# Altium schematic sheet 7-JTAG & Power.SchDoc: JTAG & Power
size B; CompanyName: NGRF; Address1: 2130 Howard Drive W; Address2: North Mankato, MN 56003; Address3: www.nextgenrf.com; Revision: 2; SheetNumber: 7; SheetTotal: 7; ProjName: BytePipe X9002_HDK; SystemEngineer: ELLIOT NELSON
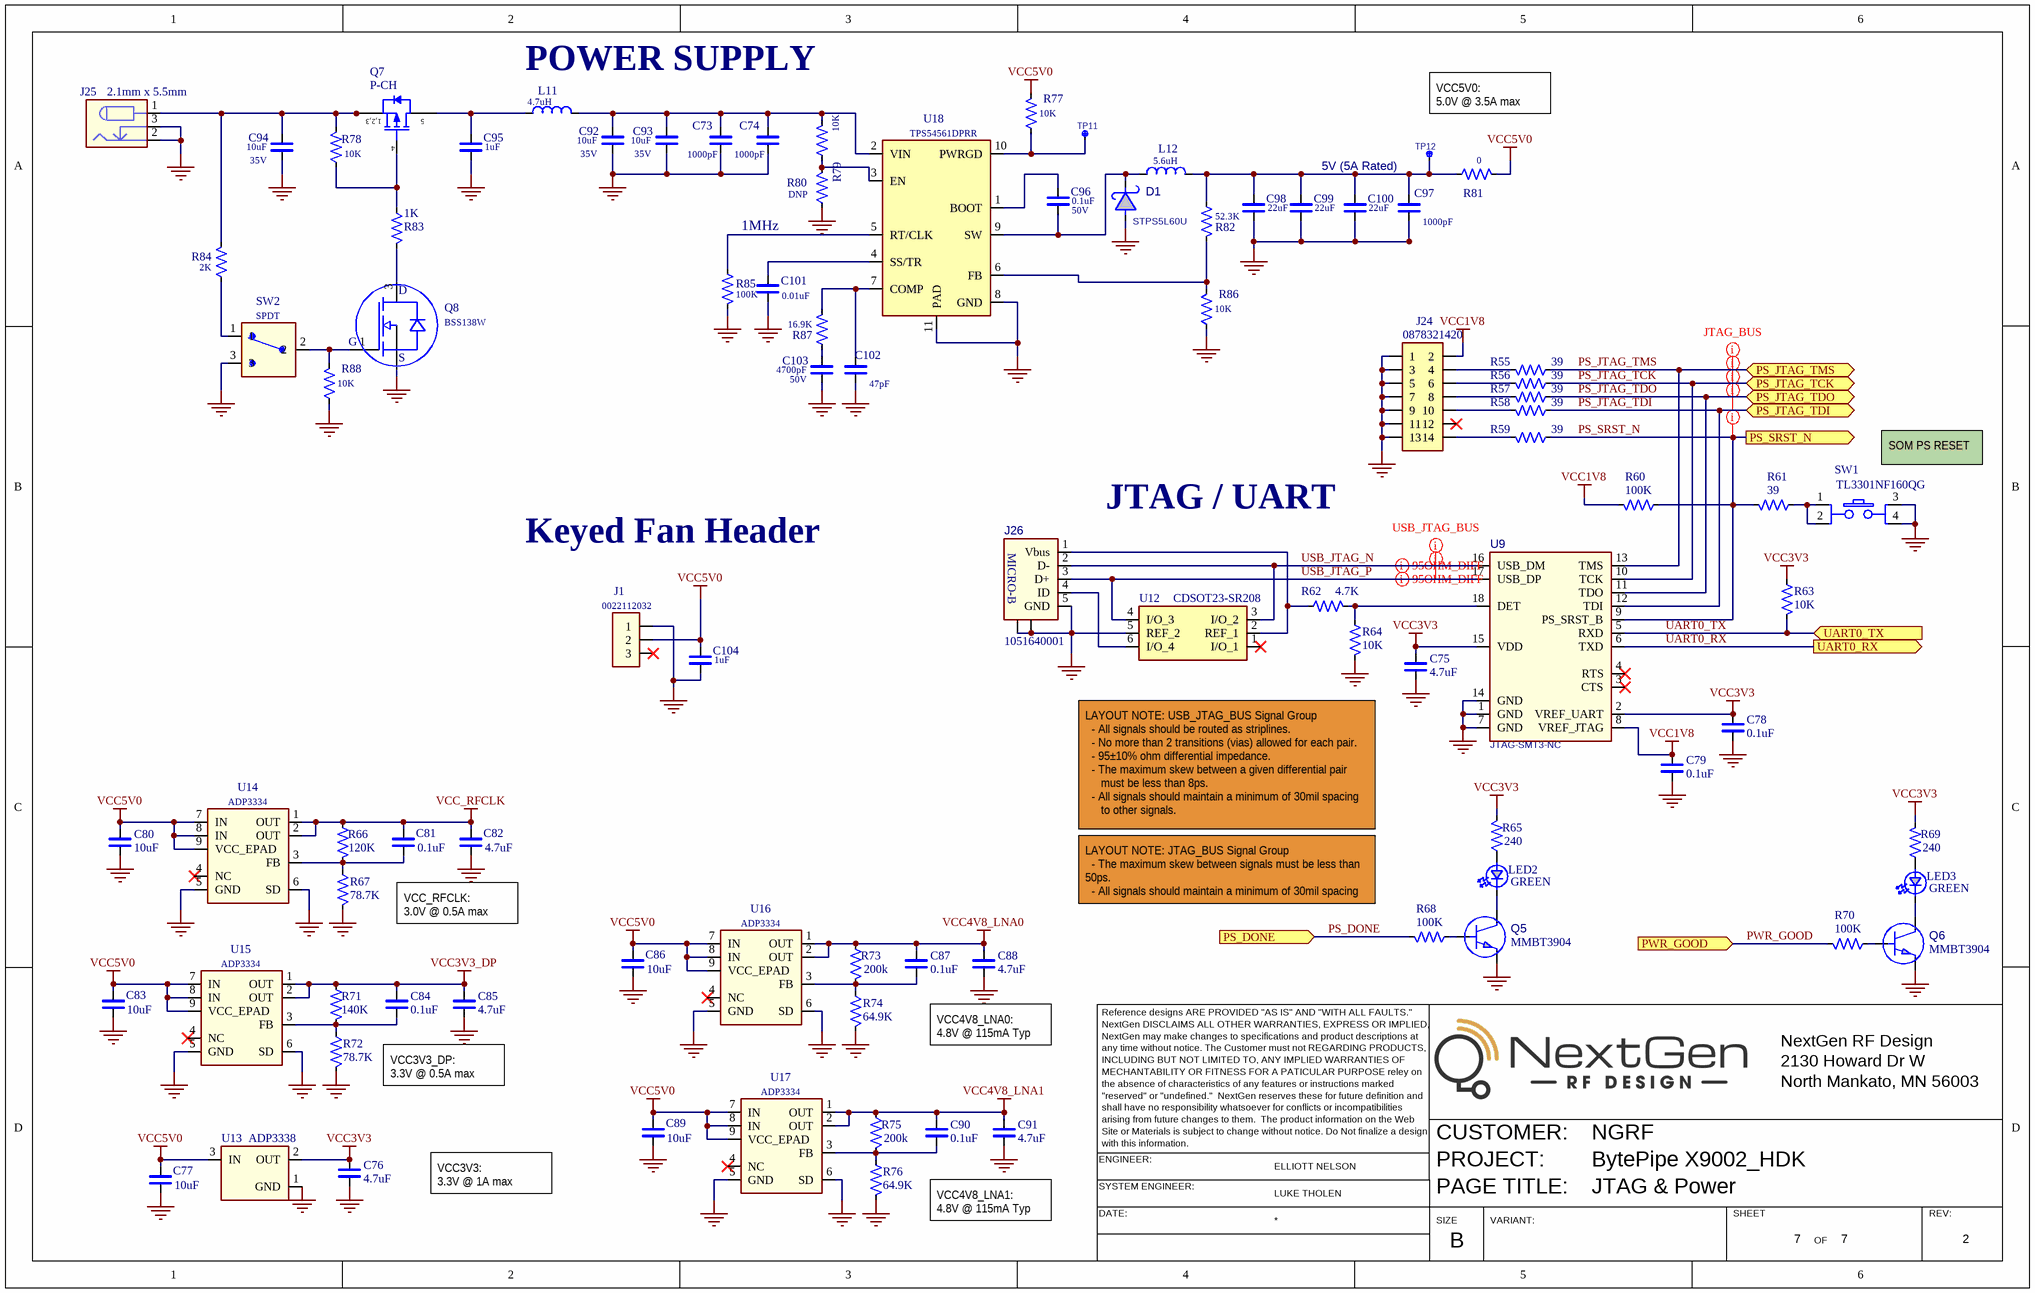
[diagram p0: 7-JTAG & Power.SchDoc]

## Parts
C73  value 1000pF  [SM/0402/CAP]
C74  value 1000pF  [SM/0402/CAP]
C75  value 4.7uF  [SM/0402/CAP]  (hidden comment: CAP_CERAMIC_0402)
C76  value 4.7uF  [SM/0402/CAP]  (hidden comment: CAP_CERAMIC_0402)
C77  value 10uF  [SM/0402/CAP]  (hidden comment: CAP_CERAMIC_0402)
C78  value 0.1uF  [SM/0402/CAP]  (hidden comment: CAP_CERAMIC_0402)
C79  value 0.1uF  [SM/0402/CAP]  (hidden comment: CAP_CERAMIC_0402)
C80  value 10uF  [SM/0402/CAP]  (hidden comment: CAP_CERAMIC_0402)
C81  value 0.1uF  [SM/0402/CAP]  (hidden comment: CAP_CERAMIC_0402)
C82  value 4.7uF  [SM/0402/CAP]  (hidden comment: CAP_CERAMIC_0402)
C83  value 10uF  [SM/0402/CAP]  (hidden comment: CAP_CERAMIC_0402)
C84  value 0.1uF  [SM/0402/CAP]  (hidden comment: CAP_CERAMIC_0402)
C85  value 4.7uF  [SM/0402/CAP]  (hidden comment: CAP_CERAMIC_0402)
C86  value 10uF  [SM/0402/CAP]  (hidden comment: CAP_CERAMIC_0402)
C87  value 0.1uF  [SM/0402/CAP]  (hidden comment: CAP_CERAMIC_0402)
C88  value 4.7uF  [SM/0402/CAP]  (hidden comment: CAP_CERAMIC_0402)
C89  value 10uF  [SM/0402/CAP]  (hidden comment: CAP_CERAMIC_0402)
C90  value 0.1uF  [SM/0402/CAP]  (hidden comment: CAP_CERAMIC_0402)
C91  value 4.7uF  [SM/0402/CAP]  (hidden comment: CAP_CERAMIC_0402)
C92  value 10uF  VOLT: 35V  [SM/0805/CAP]  (hidden comment: CAP_CERAMIC_0805)
C93  value 10uF  VOLT: 35V  [SM/0805/CAP]  (hidden comment: CAP_CERAMIC_0805)
C94  value 10uF  VOLT: 35V  [SM/0805/CAP]  (hidden comment: CAP_CERAMIC_0805)
C95  value 1uF  [SM/0603/CAP]  (hidden comment: CAP_CERAMIC_0603)
C96  value 0.1uF  VOLT: 50V  [SM/0402/CAP]  (hidden comment: CAP_CERAMIC_0402)
C97  value 1000pF  [SM/0402/CAP]
C98  value 22uF  [SM/0805/CAP]  (hidden comment: CAP_CERAMIC_0805)
C99  value 22uF  [SM/0805/CAP]  (hidden comment: CAP_CERAMIC_0805)
C100  value 22uF  [SM/0805/CAP]  (hidden comment: CAP_CERAMIC_0805)
C101  value 0.01uF  [SM/0402/CAP]
C102  value 47pF  [SM/0402/CAP]
C103  value 4700pF  VOLT: 50V  [SM/0402/CAP]
C104  value 1uF  [SM/0603/CAP]  (hidden comment: CAP_CERAMIC_0603)
D1  value STPS5L60U  [SM/DO-214AA/SMB_A]  (hidden comment: DIODE_SCHOTTKY SMB)
J1  0022112032  [CON/MLX/0022112032/3P]
J24  value 0878321420  [SM/CON/MLX/0878321420]  (hidden comment: CON_MOLEX_0878321420_14P)
J25  value 2.1mm x 5.5mm  [CON/WURTH/694106301002]  (hidden comment: CON_WURTH_694106301002)
J26  value 1051640001  [SM/CON/USB/MICRO B RA]  (hidden comment: CON_USB_MICRO-B_RA)
L11  value 4.7uH  [SM/IND/COILCRAFT/XAL4020]  (hidden comment: IND_COILCRAFT_XAL4020)
L12  value 5.6uH  [SM/IND/COILCRAFT/XAL7030]  (hidden comment: IND_COILCRAFT_XAL7030)
LED2  value GREEN  [SM/LED_0603]  (hidden comment: LED_0603)
LED3  value GREEN  [SM/LED_0603]  (hidden comment: LED_0603)
Q5  value MMBT3904  [SM/SOT23_A]  (hidden comment: TRANSISTOR_NPN_SOT23)
Q6  value MMBT3904  [SM/SOT23_A]  (hidden comment: TRANSISTOR_NPN_SOT23)
Q7  value P-CH  [SM/POWERPAK/VISHAY/SO-8]  (hidden comment: MOSFET P-CH 20V 60A PPAK SO-8)
Q8  value BSS138W  [SM/SOT323_A]  (hidden comment: FET_N-CHANNEL_SC70)
R55  value 39  [SM/0402/RES]  (hidden comment: RES_0402_A)
R56  value 39  [SM/0402/RES]  (hidden comment: RES_0402_A)
R57  value 39  [SM/0402/RES]  (hidden comment: RES_0402_A)
R58  value 39  [SM/0402/RES]  (hidden comment: RES_0402_A)
R59  value 39  [SM/0402/RES]  (hidden comment: RES_0402_A)
R60  value 100K  [SM/0402/RES]  (hidden comment: RES_0402_A)
R61  value 39  [SM/0402/RES]  (hidden comment: RES_0402_A)
R62  value 4.7K  [SM/0402/RES]  (hidden comment: RES_0402_A)
R63  value 10K  [SM/0402/RES]  (hidden comment: RES_0402_A)
R64  value 10K  [SM/0402/RES]  (hidden comment: RES_0402_A)
R65  value 240  [SM/0402/RES]  (hidden comment: RES_0402_A)
R66  value 120K  [SM/0402/RES]  (hidden comment: RES_0402_A)
R67  value 78.7K  [SM/0402/RES]  (hidden comment: RES_0402_A)
R68  value 100K  [SM/0402/RES]  (hidden comment: RES_0402_A)
R69  value 240  [SM/0402/RES]  (hidden comment: RES_0402_A)
R70  value 100K  [SM/0402/RES]  (hidden comment: RES_0402_A)
R71  value 140K  [SM/0402/RES]  (hidden comment: RES_0402_A)
R72  value 78.7K  [SM/0402/RES]  (hidden comment: RES_0402_A)
R73  value 200k  [SM/0402/RES]  (hidden comment: RES_0402_A)
R74  value 64.9K  [SM/0402/RES]  (hidden comment: RES_0402_A)
R75  value 200k  [SM/0402/RES]  (hidden comment: RES_0402_A)
R76  value 64.9K  [SM/0402/RES]  (hidden comment: RES_0402_A)
R77  value 10K  [SM/0402/RES]  (hidden comment: RES_0402_A)
R78  value 10K  [SM/0402/RES]  (hidden comment: RES_0402_A)
R79  value 10K  [SM/0402/RES]  (hidden comment: RES_0402_A)
R80  value DNP  [SM/0402/RES]  (hidden comment: RES_0402_A)
R81  value 0  [SM/0805/RES]  (hidden comment: RES_0805_A)
R82  value 52.3K  [SM/0402/RES]  (hidden comment: RES_0402_A)
R83  value 1K  [SM/0402/RES]  (hidden comment: RES_0402_A)
R84  value 2K  [SM/0402/RES]  (hidden comment: RES_0402_A)
R85  value 100K  [SM/0402/RES]  (hidden comment: RES_0402_A)
R86  value 10K  [SM/0402/RES]  (hidden comment: RES_0402_A)
R87  value 16.9K  [SM/0402/RES]  (hidden comment: RES_0402_A)
R88  value 10K  [SM/0402/RES]  (hidden comment: RES_0402_A)
SW1  value TL3301NF160QG  [SM/SWITCH/E-SWITCH/SPST]  (hidden comment: SWITCH_E-SWITCH_TACTILE_SPST)
SW2  value SPDT  [SWITCH/NIDEC/SPDT/AS1D-2M-10-Z]  (hidden comment: AS1D-2M-10-Z)
TP11  TESTPOINT_030  [SM/TESTPOINT/30MIL]  (value not drawn)  (no BOM)
TP12  TESTPOINT_030  [SM/TESTPOINT/30MIL]  (value not drawn)  (no BOM)
U9  value JTAG-SMT3-NC  [SM/MODULE/DIGILENT/JTAG-SMT3]  (hidden comment: MODULE_JTAG-SMT3-NC_18P)
U12  value CDSOT23-SR208  [SM/SOT23-6_C]  (hidden comment: TVS_CDSOT23_SOT23-6_C)
U13  value ADP3338  [SM/SOT223-3_B]  (hidden comment: REG_ADP3338_SOT223-3)
U14  value ADP3334  [SM/DFN8/3x3MM_B]  (hidden comment: REG_ADP334_DFN-8)
U15  value ADP3334  [SM/DFN8/3x3MM_B]  (hidden comment: REG_ADP334_DFN-8)
U16  value ADP3334  [SM/DFN8/3x3MM_B]  (hidden comment: REG_ADP334_DFN-8)
U17  value ADP3334  [SM/DFN8/3x3MM_B]  (hidden comment: REG_ADP334_DFN-8)
U18  value TPS54561DPRR  [SM/WSON10/4x4MM_A]  (hidden comment: REG_TPS54561_WSON-10)

## Ports
PS_DONE (in), PS_JTAG_TCK (bidir), PS_JTAG_TDI (bidir), PS_JTAG_TDO (bidir), PS_JTAG_TMS (bidir), PS_SRST_N (out), PWR_GOOD (in), UART0_RX (out), UART0_TX (in)

## Nets
GND: C73.1(N1) C74.1(N1) C75.2(N2) C76.2(N2) C77.2(N2) C78.2(N2) C79.2(N2) C80.2(N2) C82.2(N2) C83.2(N2) C85.2(N2) C86.2(N2) C88.2(N2) C89.2(N2) C91.2(N2) C92.2(N2) C93.2(N2) C94.2(N2) C95.2(N2) C97.1(N1) C98.2(N2) C99.2(N2) C100.2(N2) C101.1(N1) C102.1(N1) C103.2(N2) C104.2(N2) D1.2(A) J1.1 J24.1 J24.3 J24.5 J24.7 J24.9 J24.11 J24.13 J25.2 J25.3 J26.5(GND) J26.SH J26.TH Q5.2(E) Q6.2(E) Q8.2(SOURCE) R64.2 R67.1 R72.1 R74.1 R76.1 R80.1 R85.2 R86.2 R88.2 SW1.3 SW1.4 SW2.3 U9.1(GND) U9.7(GND) U9.14(GND) U12.5(REF_2) U13.1(GND) U14.5(GND) U14.6(SD) U15.5(GND) U15.6(SD) U16.5(GND) U16.6(SD) U17.5(GND) U17.6(SD) U18.8(GND) U18.11(PAD)
VCC1V8: C79.1(N1) J24.2 R60.2 U9.8(VREF_JTAG)
VCC3V3: C75.1(N1) C76.1(N1) C78.1(N1) R63.1 R65.1 R69.1 U9.2(VREF_UART) U9.15(VDD) U13.2(OUT)
VCC3V3_DP: C84.1(N1) C85.1(N1) R71.2 U15.1(OUT) U15.2(OUT)
VCC4V8_LNA0: C87.1(N1) C88.1(N1) R73.2 U16.1(OUT) U16.2(OUT)
VCC4V8_LNA1: C90.1(N1) C91.1(N1) R75.2 U17.1(OUT) U17.2(OUT)
VCC5V0: C77.1(N1) C80.1(N1) C83.1(N1) C86.1(N1) C89.1(N1) C104.1(N1) J1.2 R77.1 R81.2 U13.3(IN) U14.7(IN) U14.8(IN) U14.9(VCC_EPAD) U15.7(IN) U15.8(IN) U15.9(VCC_EPAD) U16.7(IN) U16.8(IN) U16.9(VCC_EPAD) U17.7(IN) U17.8(IN) U17.9(VCC_EPAD)
VCC_RFCLK: C81.1(N1) C82.1(N1) R66.2 U14.1(OUT) U14.2(OUT)
PS_DONE: R68.2 ; port PS_DONE
PS_JTAG_TCK: R56.1 U9.10(TCK) ; port PS_JTAG_TCK
PS_JTAG_TDI: R58.1 U9.12(TDI) ; port PS_JTAG_TDI
PS_JTAG_TDO: R57.1 U9.11(TDO) ; port PS_JTAG_TDO
PS_JTAG_TMS: R55.1 U9.13(TMS) ; port PS_JTAG_TMS
PS_SRST_N: R59.1 R60.1 R61.2 U9.9(PS_SRST_B) ; port PS_SRST_N
PWR_GOOD: R70.2 ; port PWR_GOOD
UART0_RX: U9.6(TXD) ; port UART0_RX
UART0_TX: R63.2 U9.5(RXD) ; port UART0_TX
USB_JTAG_N: J26.2(D-) U9.16(USB_DM) U12.3(I/O_2)
USB_JTAG_P: J26.3(D+) U9.17(USB_DP) U12.4(I/O_3)
NetC73_2: C73.2(N2) C74.2(N2) C92.1(N1) C93.1(N1) L11.2(N2) R79.2 U18.2(VIN)
NetC81_2: C81.2(N2) R66.1 R67.2 U14.3(FB)
NetC84_2: C84.2(N2) R71.1 R72.2 U15.3(FB)
NetC87_2: C87.2(N2) R73.1 R74.2 U16.3(FB)
NetC90_2: C90.2(N2) R75.1 R76.2 U17.3(FB)
NetC94_1: C94.1(N1) J25.1 Q7.1(SOURCE) Q7.2(SOURCE) Q7.3(SOURCE) R78.1 R84.1
NetC95_1: C95.1(N1) L11.1(N1) Q7.5(DRAIN)
NetC96_1: C96.1(N1) U18.1(BOOT)
NetC96_2: C96.2(N2) D1.1(K) L12.1(N1) U18.9(SW)
NetC97_2: C97.2(N2) C98.1(N1) C99.1(N1) C100.1(N1) L12.2(N2) R81.1 R82.2 TP12.1(N1)
NetC101_2: C101.2(N2) U18.4(SS/TR)
NetC102_2: C102.2(N2) R87.2 U18.7(COMP)
NetC103_1: C103.1(N1) R87.1
NetJ24_4: J24.4 R55.2
NetJ24_6: J24.6 R56.2
NetJ24_8: J24.8 R57.2
NetJ24_10: J24.10 R58.2
NetJ24_14: J24.14 R59.2
NetJ26_1: J26.1(Vbus) R62.1 U12.2(REF_1)
NetJ26_4: J26.4(ID) U12.6(I/O_4)
NetLED2_1: LED2.1(C) Q5.3(C)
NetLED2_2: LED2.2(A) R65.2
NetLED3_1: LED3.1(C) Q6.3(C)
NetLED3_2: LED3.2(A) R69.2
NetQ5_1: Q5.1(B) R68.1
NetQ6_1: Q6.1(B) R70.1
NetQ7_4: Q7.4(GATE) R78.2 R83.1
NetQ8_1: Q8.1(GATE) R88.1 SW2.2
NetQ8_3: Q8.3(DRAIN) R83.2
NetR61_1: R61.1 SW1.1 SW1.2
NetR62_2: R62.2 R64.1 U9.18(DET)
NetR77_2: R77.2 TP11.1(N1) U18.10(PWRGD)
NetR79_1: R79.1 R80.2 U18.3(EN)
NetR82_1: R82.1 R86.1 U18.6(FB)
NetR84_2: R84.2 SW2.1
NetR85_1: R85.1 U18.5(RT/CLK)

Not connected (* = marked no-connect by the designer): J1 3*; J24 12*; U9 3(CTS)* 4(RTS)*; U12 1(I/O_1)*; U14 4(NC)*; U15 4(NC)*; U16 4(NC)*; U17 4(NC)*

## Layout directives
net class USB_JTAG_BUS: USB_JTAG_N, USB_JTAG_P
net class JTAG_BUS: PS_JTAG_TCK, PS_JTAG_TDI, PS_JTAG_TDO, PS_JTAG_TMS, PS_SRST_N
differential pair; Impedance: 90 Ohms; differential pair class 95OHM_DIFF: USB_JTAG_N, USB_JTAG_P

## Notes on the sheet
- (near L11) POWER SUPPLY
- VCC5V0:
  5.0V @ 3.5A max
- 1MHz
- 5V (5A Rated)
- (near SW1) SOM PS RESET
- Keyed Fan Header
- JTAG / UART
- LAYOUT NOTE: USB_JTAG_BUS Signal Group
  - All signals should be routed as striplines.
  - No more than 2 transitions (vias) allowed for each pair.
  - 95±10% ohm differential impedance.
  - The maximum skew between a given differential pair
  must be less than 8ps.
  - All signals should maintain a minimum of 30mil spacing
  to other signals.
- (near R68) LAYOUT NOTE: JTAG_BUS Signal Group
  - The maximum skew between signals must be less than 50ps.
  - All signals should maintain a minimum of 30mil spacing to
  other signals outside this signal group.
- VCC_RFCLK:
  3.0V @ 0.5A max
- VCC4V8_LNA0:
  4.8V @ 115mA Typ
- Reference designs ARE PROVIDED "AS IS" AND "WITH ALL FAULTS."
- NextGen DISCLAIMS ALL OTHER WARRANTIES, EXPRESS OR IMPLIED,
- NextGen may make changes to specifications and product descriptions at
- NextGen RF Design
- VCC3V3_DP:
  3.3V @ 0.5A max
- any time without notice. The Customer must not REGARDING PRODUCTS,
- INCLUDING BUT NOT LIMITED TO, ANY IMPLIED WARRANTIES OF
- MECHANTABILITY OR FITNESS FOR A PATICULAR PURPOSE reley on
- "reserved" or "undefined."  NextGen reserves these for future definition and
- the absence of characteristics of any features or instructions marked
- shall have no responsibility whatsoever for conflicts or incompatibilities
- 2130 Howard Dr W
- North Mankato, MN 56003
- ENGINEER:
- Site or Materials is subject to change without notice. Do Not finalize a design
- with this information.
- arising from future changes to them.  The product information on the Web
- ELLIOTT NELSON
- CUSTOMER:
- PROJECT:
- VCC3V3:
  3.3V @ 1A max
- VCC4V8_LNA1:
  4.8V @ 115mA Typ
- SYSTEM ENGINEER:
- DATE:
- LUKE THOLEN
- SIZE
- PAGE TITLE:
- VARIANT:
- SHEET
- OF
- REV:
- B
- (in symbol CON_USB_MICRO-B_RA) MICRO-B
- (in symbol FET_N-CHANNEL_SC70) D; G; S
- (in symbol FET_P-CHANNEL_PPAK-SO-8) 1,2,3

## Library data of the parts
C73 C74 C97 = CAP_CERAMIC_0402: CAP CER 1000PF 50V C0G/NP0 0402; TOL: 1%; OEM#: GRM1555C1H102FA01D; OEM NAME: Murata Electronics; VOLT: 50V
C75 C76 C82 C85 C88 C91 = CAP_CERAMIC_0402: CAP CER 4.7UF 10V X5R 0402; TOL: ±20%; OEM#: CL05A475MP5NRNC; OEM NAME: Samsung; VOLT: 10V
C77 C80 C83 C86 C89 = CAP_CERAMIC_0402: 10µF ±20% 10V Ceramic Capacitor X5R 0402 (1005 Metric); OEM#: CL05A106MP8NUB8; OEM NAME: Samsung; TOL: ±20%; VOLT: 10V
C78 C79 C81 C84 C87 C90 = CAP_CERAMIC_0402: CAP CER 0.1UF 25V X7R 0402; TOL: ±10%; OEM#: CL05B104KA5NNNC; OEM NAME: Samsung; VOLT: 25V
C92 C93 = CAP_CERAMIC_0805: CAP CER 10UF 35V X5R 0805; OEM#: GRM21BR6YA106ME43L; OEM NAME: Murata Electronics; TOL: 20%
C94 = CAP_CERAMIC_0805: CAP CER 10UF 35V X5R 0805; OEM#: GMK212BBJ106MG-T; OEM NAME: Taiyo Yuden; TOL: 20%
C95 C104 = CAP_CERAMIC_0603: TOL: 10%; OEM#: GRT188R61H105KE13D; OEM NAME: Murata; VOLT: 50V
C96 = CAP_CERAMIC_0402: CAP CER 0.1UF 50V X7R 0402; TOL: 10%; OEM#: CGA2B3X7R1H104K050BB; OEM NAME: TDK Corporation
C98-C100 = CAP_CERAMIC_0805: CAP CER 22UF 16V X5R 0805; OEM#: GRM219R61C226ME15L; OEM NAME: Murata Electronics; TOL: 20%; VOLT: 16V
C101 = CAP_CERAMIC_0402: CAP CER 10000PF 50V X7R 0402; TOL: 10%; OEM#: GCM155R71H103KA55J; OEM NAME: Murata Electronics; VOLT: 50V
C102 = CAP_CERAMIC_0402: CAP CER 47PF 50V C0G/NP0 0402; TOL: 5%; OEM#: GCM1555C1H470JA16D; OEM NAME: Murata Electronics; VOLT: 50V
C103 = CAP_CERAMIC_0402: CAP CER 4700PF 50V X7R 0402; TOL: 10%; OEM#: GRM155R71H472KA01J; OEM NAME: Murata
D1 = DIODE_SCHOTTKY SMB: DIODE SCHOTTKY 60V 5A SMB; OEM NAME: STMicroelectronics; OEM#: STPS5L60U
J1 = CON_100SP_1X3P_MLX_KK100: Connector Header Through Hole 3 position 0.100" (2.54mm).  Molex KK 100 Series.; OEM#: 0022112032; OEM NAME: MOLEX; VALUE: 0022112032
J24 = CON_MOLEX_0878321420_14P: Connector Header Surface Mount 14 position 0.079" (2.00mm); OEM NAME: MOLEX; OEM#: 0878321420
J25 = CON_WURTH_694106301002: Wurth DC power jack, 2.1mm pin, right angle; OEM#: 694106301002; OEM NAME: WURTH
J26 = CON_USB_MICRO-B_RA: USB MICRO-B RIGHT ANGLE, MOLEX 1051640001; OEM NAME: Molex, LLC; OEM#: 1051640001
L11 = IND_COILCRAFT_XAL4020: Fixed Inductors 4.7uH 20% 5.1A 44.1mOhms AEC-Q200; OEM#: XAL4030-472MEC; OEM NAME: Coilcraft
L12 = IND_COILCRAFT_XAL7030: OEM#: XAL7030-562MEC; OEM NAME: Coilcraft
LED2 LED3 = LED_0603: LED-0603; OEM#: LG L29K-F2J1-24-Z; OEM NAME: OSRAM
Q5 Q6 = TRANSISTOR_NPN_SOT23: Bipolar (BJT) Transistor NPN 40V 200mA 300MHz 300mW Surface Mount SOT-23-3 (TO-236); OEM#: MMBT3904LT1G; OEM NAME: ON Semiconductor
Q7 = FET_P-CHANNEL_PPAK-SO-8: P-Channel 20 V 60A (Tc) 6.25W (Ta), 104W (Tc) Surface Mount PowerPAK® SO-8; OEM NAME: VISHAY SILICONIX; OEM#: SI7157DP-T1-GE3
Q8 = FET_N-CHANNEL_SC70: FET, N-Channel, SC70/SOT323; OEM NAME: ON Semi; OEM#: BSS138W
R55-R59 R61 = RES_0402_A: RES SMD 39 OHM 1% 1/10W 0402; OEM#: ERJ-2RKF39R0X; OEM NAME: Panasonic; TOL: 1%
R60 R68 R70 R85 = RES_0402_A: RES SMD 100K OHM 1% 1/10W 0402; OEM#: ERJ-2RKF1003X; OEM NAME: Panasonic; TOL: 1%
R62 = RES_0402_A: RES SMD 4.7K OHM 1% 1/10W 0402; OEM#: ERJ-2RKF4701X; OEM NAME: Panasonic; TOL: 1%
R63 R64 = RES_0402_A: OEM#: ERJ-2RKF1002X; OEM NAME: Panasonic; TOL: ±1%
R65 R69 = RES_0402_A: RES SMD 240 OHM 1% 1/10W 0402; OEM#: ERJ-2RKF2400X; OEM NAME: Panasonic; TOL: 1%
R66 = RES_0402_A: RES 120K OHM 1% 1/10W 0402 SMD; OEM#: ERJ-2RKF1203X; OEM NAME: Panasonic; TOL: ±1%
R67 R72 = RES_0402_A: RES SMD 78.7K OHM 1% 1/10W 0402; OEM#: ERJ-2RKF7872X; OEM NAME: Panasonic; TOL: ±1%
R71 = RES_0402_A: RES SMD 140K OHM 1% 1/10W 0402; OEM#: ERJ-2RKF1403X; OEM NAME: Panasonic; TOL: ±1%
R73 R75 = RES_0402_A: RES SMD 200K OHM 1% 1/10W 0402; OEM#: ERJ-2RKF2003X; OEM NAME: Panasonic; TOL: ±1%
R74 R76 = RES_0402_A: RES SMD 64.9K OHM 1% 1/10W 0402; OEM#: ERJ-2RKF6492X; OEM NAME: Panasonic; TOL: ±1%
R77-R79 R86 R88 = RES_0402_A: RES SMD 10K OHM 1% 1/10W 0402; OEM#: ERJ-2RKF1002X; OEM NAME: Panasonic; TOL: 1%
R80 = RES_0402_A: DNP; OEM NAME: Panasonic; OEM#: DNP
R81 = RES_0805_A: RES SMD 0 OHM JUMPER 1/8W 0805; OEM#: ERJ-6GEY0R00V; OEM NAME: Panasonic
R82 = RES_0402_A: RES SMD 52.3K OHM 1% 1/10W 0402; OEM#: ERJ-2RKF5232X; OEM NAME: Panasonic; TOL: 1%
R83 = RES_0402_A: RES SMD 1K OHM 1% 1/10W 0402; OEM#: ERJ-2RKF1001X; OEM NAME: Panasonic; TOL: ±1%
R84 = RES_0402_A: RES SMD 2 KOHM 1% 1/5W 0402; OEM#: ERJ-PA2F2001X; OEM NAME: Panasonic Electronic Components; TOL: 1%
R87 = RES_0402_A: RES SMD 16.9K OHM 1% 1/10W 0402; OEM#: ERJ-2RKF1692X; OEM NAME: Panasonic; TOL: 1%
SW1 = SWITCH_E-SWITCH_TACTILE_SPST: Tactile Switch SPST-NO Top Actuated Surface Mount; OEM#: TL3301NF160QG; OEM NAME: E-SWITCH
SW2 = SWITCH_SLIDE_NIDEC_SPDT: SWITCH SLIDE SPDT 50MA 48V; OEM NAME: Nidec Copal Electronics; OEM#: AS1D-2M-10-Z
U9 = MODULE_JTAG-SMT3-NC_18P: SMT Programming module for Xilinx FPGAs.; OEM NAME: DIGILENT; OEM#: JTAG-SMT3-NC
U12 = TVS_CDSOT23_SOT23-6_C: Clamp Ipp Tvs Diode Surface Mount SOT-23-6.; OEM NAME: Bourns Inc.; OEM#: CDSOT23-SR208
U13 = REG_ADP3338_SOT223-3: Linear Voltage Regulator IC 3.3V Output 1A SOT-223-3; OEM NAME: ANALOG DEVICES; OEM#: ADP3338AKCZ-3.3-RL
U14-U17 = REG_ADP334_DFN-8: Linear Voltage Regulator IC  1 Output  500mA 8-LFCSP-WD (3x3); OEM#: ADP3334ACPZ-REEL7; OEM NAME: ANALOG DEVICES
U18 = REG_TPS54561_WSON-10: 4.5-V to 60-V Input, 5-A, Step-Down DC-DC Converter with Soft-Start and Eco-mode; OEM NAME: Texas Instruments; OEM#: TPS54561DPRR